# Altium project unicorn_1.PrjPcb
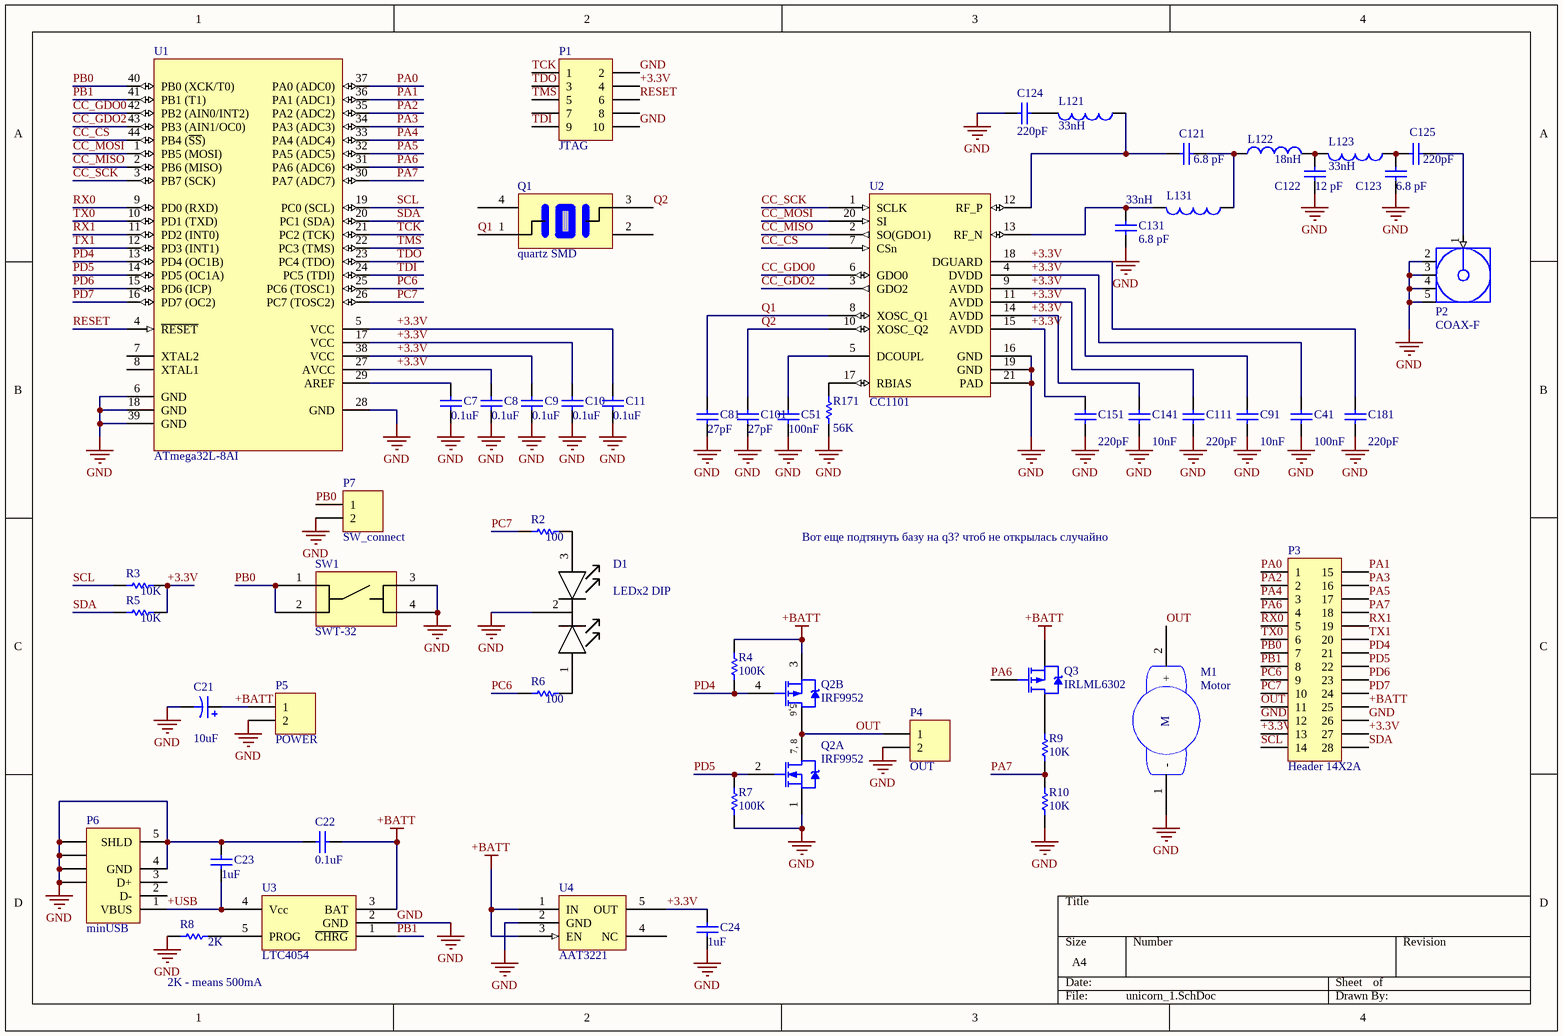
[diagram p0: unicorn_1.SchDoc]
1 sheet, 55 parts. Net scope: global (net labels, ports and power ports of the same name join across sheets).
Board file: unicorn_1.PcbDoc

## Sheet unicorn_1.SchDoc
size A4

### Parts
C7  0.1uF  [CAPC1005L]
C8  0.1uF  [CAPC1005L]
C9  0.1uF  [CAPC1005L]
C10  0.1uF  [CAPC1005L]
C11  0.1uF  [CAPC1005L]
C21  10uF  [CAPC2012L]
C22  0.1uF  [CAPC1005L]
C23  1uF  [CAPC1608L]
C24  1uF  [CAPC1608L]
C41  100nF  [CAPC1005L]
C51  100nF  [CAPC1005L]
C81  27pF  [CAPC1005L]
C91  10nF  [CAPC1005L]
C101  27pF  [CAPC1005L]
C111  220pF  [CAPC1005L]
C121  6.8 pF  [CAPC1005L]
C122  12 pF  [CAPC1005L]
C123  6.8 pF  [CAPC1005L]
C124  220pF  [CAPC1005L]
C125  220pF  [CAPC1005L]
C131  6.8 pF  [CAPC1005L]
C141  10nF  [CAPC1005L]
C151  220pF  [CAPC1005L]
C181  220pF  [CAPC1005L]
D1  LEDx2 DIP  [LEDx2]
L121  33nH  [INDC1005AL]
L122  18nH  [INDC1005AL]
L123  33nH  [INDC1005AL]
L131  33nH  [INDC1005AL]
M1  Motor  [Motor]
P1  JTAG  [HDR2X5]
P2  COAX-F  [MCX5.08-H5]
P3  Header 14X2A  [HDR2X14_CEN]
P4  OUT  [HDR1X2H]
P5  POWER  [HDR1X2H]
P6  minUSB  [440479]
P7  SW_connect  [HDR1X2]
Q1  quartz SMD  [quartz_pattern]
Q2  IRF9952  [SO-8_N]  (parts A,B of 2)
Q3  IRLML6302  [SOT-23]
R2  100  [RESC1005L]
R3  10K  [RESC1005L]
R4  100K  [RESC1005L]
R5  10K  [RESC1005L]
R6  100  [RESC1005L]
R7  100K  [RESC1005L]
R8  2K  [RESC1005L]
R9  10K  [RESC1005L]
R10  10K  [RESC1005L]
R171  56K  [RESC1005L]
SW1  SWT-32  [SWT-32 pattern]
U1  ATmega32L-8AI  [44A_L]
U2  CC1101  [QFN50P397X397X80-20N]
U3  LTC4054  [SOT95P270X100-5N]
U4  AAT3221  [SOT95P280X145-5N]

### Nets
+BATT: C21.1 C22.2 P3.25 P5.1 Q2.3(S2) Q3.2(S) R4.1 U3.3(BAT) U4.1(IN) U4.3(EN)
GND: C7.2 C8.2 C9.2 C10.2 C11.2 C21.2 C22.1 C23.1 C24.2 C41.1 C51.1 C81.1 C91.1 C101.1 C111.1 C122.1 C123.1 C124.2 C131.2 C141.1 C151.1 C181.1 D1.2(GND) M1.1(-) P1.2 P1.10 P2.2(GND) P2.3(GND) P2.4(GND) P2.5(GND) P3.12 P3.26 P4.2 P5.2 P6.4(GND) P6.5(SHLD) P6.6(SHLD) P6.7(SHLD) P6.8(SHLD) P6.9(SHLD) P7.2 Q2.1(S1) R7.2 R8.2 R10.2 R171.1 SW1.3 SW1.4 U1.6(GND) U1.18(GND) U1.28(GND) U1.39(GND) U2.16(GND) U2.19(GND) U2.21(PAD) U3.2(GND) U4.2(GND)
+3.3V: C8.1 C9.1 C10.1 C11.1 C24.1 C41.2 C91.2 C111.2 C141.2 C151.2 C181.2 P1.4 P3.13 P3.27 R3.1 R5.1 U1.5(VCC) U1.17(VCC) U1.27(AVCC) U1.38(VCC) U2.4(DVDD) U2.9(AVDD) U2.11(AVDD) U2.14(AVDD) U2.15(AVDD) U2.18(DGUARD) U4.5(OUT)
+USB: C23.2 P6.1(VBUS) U3.4(Vcc)
CC_CS: U1.44(PB4_(~{SS})) U2.7(CSn)
CC_GDO0: U1.42(PB2_(AIN0/INT2)) U2.6(GDO0)
CC_GDO2: U1.43(PB3_(AIN1/OC0)) U2.3(GDO2)
CC_MISO: U1.2(PB6_(MISO)) U2.2(SO(GDO1))
CC_MOSI: U1.1(PB5_(MOSI)) U2.20(SI)
CC_SCK: U1.3(PB7_(SCK)) U2.1(SCLK)
OUT: M1.2(+) P3.11 P4.1 Q2.5(D2) Q2.6(D2) Q2.7(D1) Q2.8(D1)
PA0: P3.1 U1.37(PA0_(ADC0))
PA1: P3.15 U1.36(PA1_(ADC1))
PA2: P3.2 U1.35(PA2_(ADC2))
PA3: P3.16 U1.34(PA3_(ADC3))
PA4: P3.3 U1.33(PA4_(ADC4))
PA5: P3.17 U1.32(PA5_(ADC5))
PA6: P3.4 Q3.1(G) U1.31(PA6_(ADC6))
PA7: P3.18 R9.2 R10.1 U1.30(PA7_(ADC7))
PB0: P3.7 P7.1 SW1.1 SW1.2 U1.40(PB0_(XCK/T0))
PB1: P3.8 U1.41(PB1_(T1)) U3.1(~{CHRG})
PC6: P3.9 R6.2 U1.25(PC6_(TOSC1))
PC7: P3.10 R2.2 U1.26(PC7_(TOSC2))
PD4: P3.21 Q2.4(G2) R4.2 U1.13(PD4_(OC1B))
PD5: P3.22 Q2.2(G1) R7.1 U1.14(PD5_(OC1A))
PD6: P3.23 U1.15(PD6_(ICP))
PD7: P3.24 U1.16(PD7_(OC2))
Q1: C81.2 Q1.1 U2.8(XOSC_Q1)
Q2: C101.2 Q1.3 U2.10(XOSC_Q2)
RESET: P1.6 U1.4(~{RESET})
RX0: P3.5 U1.9(PD0_(RXD))
RX1: P3.19 U1.11(PD2_(INT0))
SCL: P3.14 R3.2 U1.19(PC0_(SCL))
SDA: P3.28 R5.2 U1.20(PC1_(SDA))
TCK: P1.1 U1.21(PC2_(TCK))
TDI: P1.9 U1.24(PC5_(TDI))
TDO: P1.3 U1.23(PC4_(TDO))
TMS: P1.5 U1.22(PC3_(TMS))
TX0: P3.6 U1.10(PD1_(TXD))
TX1: P3.20 U1.12(PD3_(INT1))
NetC7_1: C7.1 U1.29(AREF)
NetC51_2: C51.2 U2.5(DCOUPL)
NetC121_1: C121.1 L122.1 L131.1
NetC121_2: C121.2 L121.1 U2.12(RF_P)
NetC122_2: C122.2 L122.2 L123.2
NetC123_2: C123.2 C125.2 L123.1
NetC124_1: C124.1 L121.2
NetC125_1: C125.1 P2.1(Signal)
NetC131_1: C131.1 L131.2 U2.13(RF_N)
NetD1_1: D1.1(G) R6.1
NetD1_3: D1.3(R) R2.1
NetQ3_3: Q3.3(D) R9.1
NetR8_1: R8.1 U3.5(PROG)
NetR171_2: R171.2 U2.17(RBIAS)

Not connected (* = marked no-connect by the designer): P1 7 8; P6 2(D-) 3(D+); Q1 2 4; U1 7(XTAL2) 8(XTAL1); U4 4(NC)

### Notes on the sheet
- Вот еще подтянуть базу на q3? чтоб не открылась случайно
- 2K - means 500mA
- (in symbol IRF9952, part A) 7, 8
- (in symbol IRF9952, part B) 5,6
- (in symbol Motor) M

### Library data of the parts
C7-C11 C22-C24 C41 C51 C81 C91 C101 C111 C121-C125 C131 C141 C151 C181 = Cap Semi: Capacitor (Semiconductor SIM Model); Published: 8-Jun-2000; LatestRevisionDate: 29-May-2009; LatestRevisionNote: IPC-7351 Footprint Added.; PackageReference: C1206; Publisher: Altium Limited; PackageDescription: Chip Capacitor
  C7-C11 C22: Value: 0.1uF
  C23 C24: Value: 1uF
  C41 C51: Value: 100nF
  C81 C101: Value: 27pF
  C91 C141: Value: 10nF
  C111 C124 C125 C151 C181: Value: 220pF
  C121 C123 C131: Value: 6.8 pF
  C122: Value: 12 pF
C21 = Cap Pol3: Polarized Capacitor (Surface Mount); Published: 8-Jun-2000; LatestRevisionDate: 29-May-2009; LatestRevisionNote: IPC-7351 Footprint Added.; PackageReference: C0805; Publisher: Altium Limited; PackageDescription: Chip Capacitor; Value: 10uF
D1 = LEDx2: in DIP
L121-L123 L131 = Inductor: Code_IEC: 1005; Published: 8-Jun-2000; LatestRevisionDate: 29-May-2009; LatestRevisionNote: IPC-7351 Footprint Added.; PackageReference: 0402-A; Publisher: Altium Limited; PackageDescription: Chip Inductor; Code_JEITA: 0402
  L121 L123 L131: Value: 33nH
  L122: Value: 18nH
P1 = Header 5X2: Header, 5-Pin, Dual row; LatestRevisionDate: 17-Jul-2002; LatestRevisionNote: Re-released for DXP Platform.; Publisher: Altium Limited
P2 = COAX-F: RF Coaxial PCB Connector, MCX; Thru-Hole, Right-Angle Mount Socket, Blunt Post Terminal, 50 Ohm Impedance; PCB_Layout: Complies with manufacturer's recommendation.; DrillSize: Corresponds to nominal value.; Published: 15-Jul-2004; LatestRevisionDate: 15-Jul-2004; LatestRevisionNote: Component Replaced.; DatasheetDocument: 30-May-2003; PackageDocument: 04-Jul-1999; PackageReference: 919-119J-51AX; Publisher: Altium Limited; ComponentLink1Description: Manufacturer Link; ComponentLink1URL: http://www.amphenolrf.com/
P3 = Header 14X2A: Header, 14-Pin, Dual row; LatestRevisionDate: 17-Jul-2002; LatestRevisionNote: Re-released for DXP Platform.; Publisher: Altium Limited
P4 P5 = Header 2H: Header, 2-Pin, Right Angle; LatestRevisionDate: 17-Jul-2002; LatestRevisionNote: Re-released for DXP Platform.; Publisher: Altium Limited
P6 = 440478-2: USB 2.0, Right Angle, SMT, A Type, Receptacle, 5 Position, Black; ContactMaterial: Phosphor Bronze; ContactPlating: Gold (30) over Nickel; PCB_Layout: Complies with manufacturer's recommendation.; DrillSize: Corresponds to nominal value.; PanelGround: Without; Published: 15-Jul-2004; DatasheetDocument: 15-Nov-2002; PackageDocument: 15-Nov-2002; PackageReference: 440478; Publisher: Altium Limited; HousingMaterial: Thermoplastic; ComponentLink1Description: Manufacturer Link; ComponentLink1URL: http://www.tycoelectronics.com/; ComponentLink2Description: Packaging Specification; ComponentLink2URL: http://ecommas.tycoelectronics.com/commerce/DocumentDelivery/DDEController?Action=showdoc&DocId=Customer+Drawing%7F440478%7FB%7Fpdf%7FEnglish%7FC_440478_B.pdf
P7 = Header 2: Header, 2-Pin; LatestRevisionDate: 17-Jul-2002; LatestRevisionNote: Re-released for DXP Platform.; Publisher: Altium Limited
Q1 = qartz 0532: в корпусе 0532
Q2 = IRF9952: HEXFET Power MOSFET; Published: 8-Jun-2000; LatestRevisionDate: 13-Apr-2006; LatestRevisionNote: IPC-7351 Footprint Added.; DatasheetVersion: Aug-1997; PackageVersion: Feb-2001; PackageReference: SO-8; Publisher: Altium Limited; PackageDescription: 8-Pin Plastic Small Outline Integrated Circuit 1.27 mm Pitch; Code_JEDEC: MS-012-AA; Code_IPC: SOIC127P600-8; ComponentLink1Description: Manufacturer Link; ComponentLink1URL: http://www.irf.com/; ComponentLink2Description: Datasheet; ComponentLink2URL: http://www.irf.com/product-info/datasheets/data/irf9952.pdf
Q3 = IRLML6302: HEXFET Power MOSFET; Published: 8-Jun-2000; LatestRevisionDate: 17-Jul-2002; LatestRevisionNote: Re-released for DXP Platform.; DatasheetVersion: Aug-1997; PackageReference: SOT-23; Publisher: Altium Limited; PackageDescription: SOT-23; 3 Leads; Body 3.1 x 2.5 mm, inc. leads (LxW max); ComponentLink1Description: Manufacturer Link; ComponentLink1URL: http://www.irf.com/; ComponentLink2Description: Datasheet; ComponentLink2URL: http://www.irf.com/product-info/datasheets/data/irlml6302.pdf
R2-R10 R171 = Res Semi: Semiconductor Resistor; Published: 8-Jun-2000; LatestRevisionDate: 17-Jul-2002; LatestRevisionNote: Re-released for DXP Platform.; PackageReference: AXIAL-0.5; Publisher: Altium Limited
  R2 R6: Value: 100
  R3 R5 R9 R10: Value: 10K
  R4 R7: Value: 100K
  R8: Value: 2K
  R171: Value: 56K
SW1 = SWT-32: Кнопка тактовая, поверхностный монтаж
U1 = ATmega32L-8AI: 8-Bit AVR Microcontroller with 32K Bytes of In-System Programmable Flash Memory; Published: 17-Sep-2003; LatestRevisionDate: 13-Apr-2006; LatestRevisionNote: IPC-7351 Footprint Added.; DatasheetVersion: 2503C-AVR-10/02; PackageVersion: rev.B, Oct-2001; PackageReference: 44A; Publisher: Altium Limited; PackageDescription: 44-Pin Thin Quad Flat Pack 0.8 mm Pitch; ComponentLink1Description: Manufacturer Link; ComponentLink1URL: http://www.atmel.com; ComponentLink2Description: Datasheet; ComponentLink2URL: http://www.atmel.com/dyn/resources/prod_documents/doc2503.pdf
U2 = CC1101: Low-Power Sub-1 GHz RF Transceiver
U3 = LTC4054: Standalone Linear  Li-Ion Battery Charger with  Thermal Regulation in ThinSOT
U4 = AAT3221: PowerLinear NanoPower low   dropout (LDO) linear regulator.